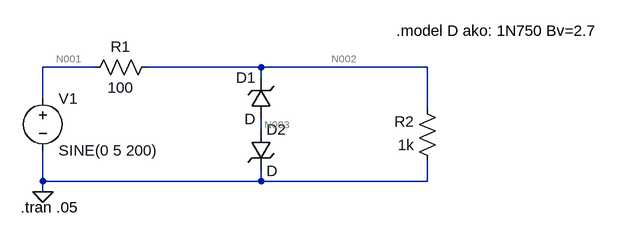
[diagram p0: schematic 1_3b.asc]
1_3b.asc, the LTspice schematic file:
Version 4
SHEET 1 880 680
WIRE 16 80 -64 80
WIRE 272 80 96 80
WIRE 528 80 272 80
WIRE 272 96 272 80
WIRE -64 128 -64 80
WIRE 528 144 528 80
WIRE 272 176 272 160
WIRE -64 256 -64 208
WIRE 272 256 272 240
WIRE 272 256 -64 256
WIRE 528 256 528 224
WIRE 528 256 272 256
WIRE -64 272 -64 256
FLAG -64 272 0
SYMBOL voltage -64 112 R0
WINDOW 123 0 0 Left 0
WINDOW 39 0 0 Left 0
SYMATTR InstName V1
SYMATTR Value SINE(0 5 200)
SYMBOL res 112 64 R90
WINDOW 0 0 56 VBottom 2
WINDOW 3 32 56 VTop 2
SYMATTR InstName R1
SYMATTR Value 100
SYMBOL res 544 240 R180
WINDOW 0 36 76 Left 2
WINDOW 3 36 40 Left 2
SYMATTR InstName R2
SYMATTR Value 1k
SYMBOL zener 288 160 R180
WINDOW 0 24 64 Left 2
WINDOW 3 24 0 Left 2
SYMATTR InstName D1
SYMBOL zener 256 176 R0
SYMATTR InstName D2
TEXT 480 24 Left 2 !.model D ako: 1N750 Bv=2.7
TEXT -98 296 Left 2 !.tran .05

The netlist it stands for:
* 1_3b.asc
V1 N001 0 SINE(0 5 200)
R1 N002 N001 100
R2 0 N002 1k
D1 N003 N002 D
D2 N003 0 D
.model D D
.lib standard.dio
.model D ako: 1N750 Bv=2.7
.tran .05
.backanno
.end

* Results of the author's LTspice run, read from the files saved beside the schematic
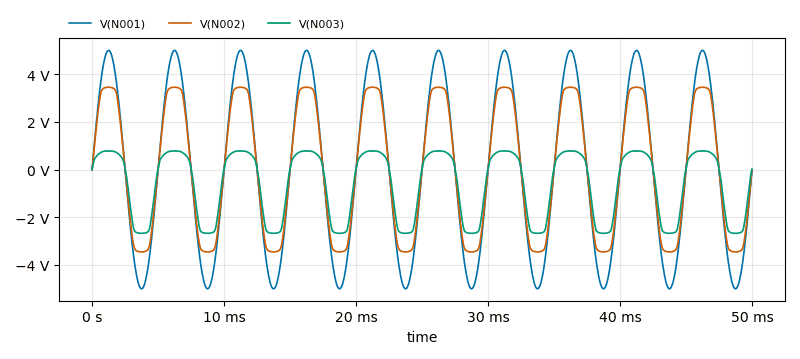
[diagram p1: Transient Analysis of 1_3b.asc, plotted from the saved traces]
* Transient Analysis, 1 run:
*   V(N001): min -5 V, max 5 V, average 52.37 µV, rms 3.535 V, last 0 V
*   V(N002): min -3.454 V, max 3.454 V, average 51.78 µV, rms 2.753 V, last -45.99 µV
*   V(N003): min -2.673 V, max 781.4 mV, average -637.1 mV, rms 1.559 V, last 19.06 mV